# Altium schematic sheet XT60PW-F_C4287221_XT60PW-F_C428722.schdoc
size 127 x 99 mm
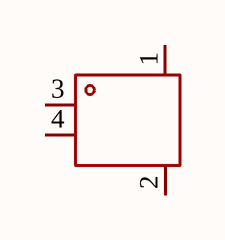
[diagram p0: XT60PW-F_C4287221_XT60PW-F_C428722.schdoc]

## Parts
U?  XT60PW-F  [TH_2P-XT60PW-F]  (value not drawn)

## Nets

Not connected (* = marked no-connect by the designer): U? 1 2 3 4

## Library data of the parts
U? = XT60PW-F: Manufacturer: AMASS(艾迈斯); Symbol: XT60PW-F_C428722; Add into BOM: yes; InterfaceType: 母头; Device: XT60PW-F; LCSC Part Name: AMASS(艾迈斯)插头连接器锂电池组充电接口 航模电调卧式焊板 母头 XT60PW-F; Supplier Part: C428722; Manufacturer Part: XT60PW-F; Supplier Footprint: -; JLCPCB Part Class: Extended Part; Datasheet: https://atta.szlcsc.com/upload/public/pdf/source/20190916/C428722_DFF78979486FCB0B58C1FC563067EC88.pdf; Supplier: LCSC; Convert to PCB: yes; Power: -; Output: -; Input: -; Size: -; Interface: -; Type: 卧式插头; Colour: 黄色; MaximumCurrent: -; RatedVoltage: -; Type1: -; NumberOfUSBHoles: -; MetalMaterial: -; InsulationMaterial: -; RatedCurrent: -; RecommendedWireGauge: -; FlameRetardantGrade: -; contact resistance: -; Belt length: -; specifications: -